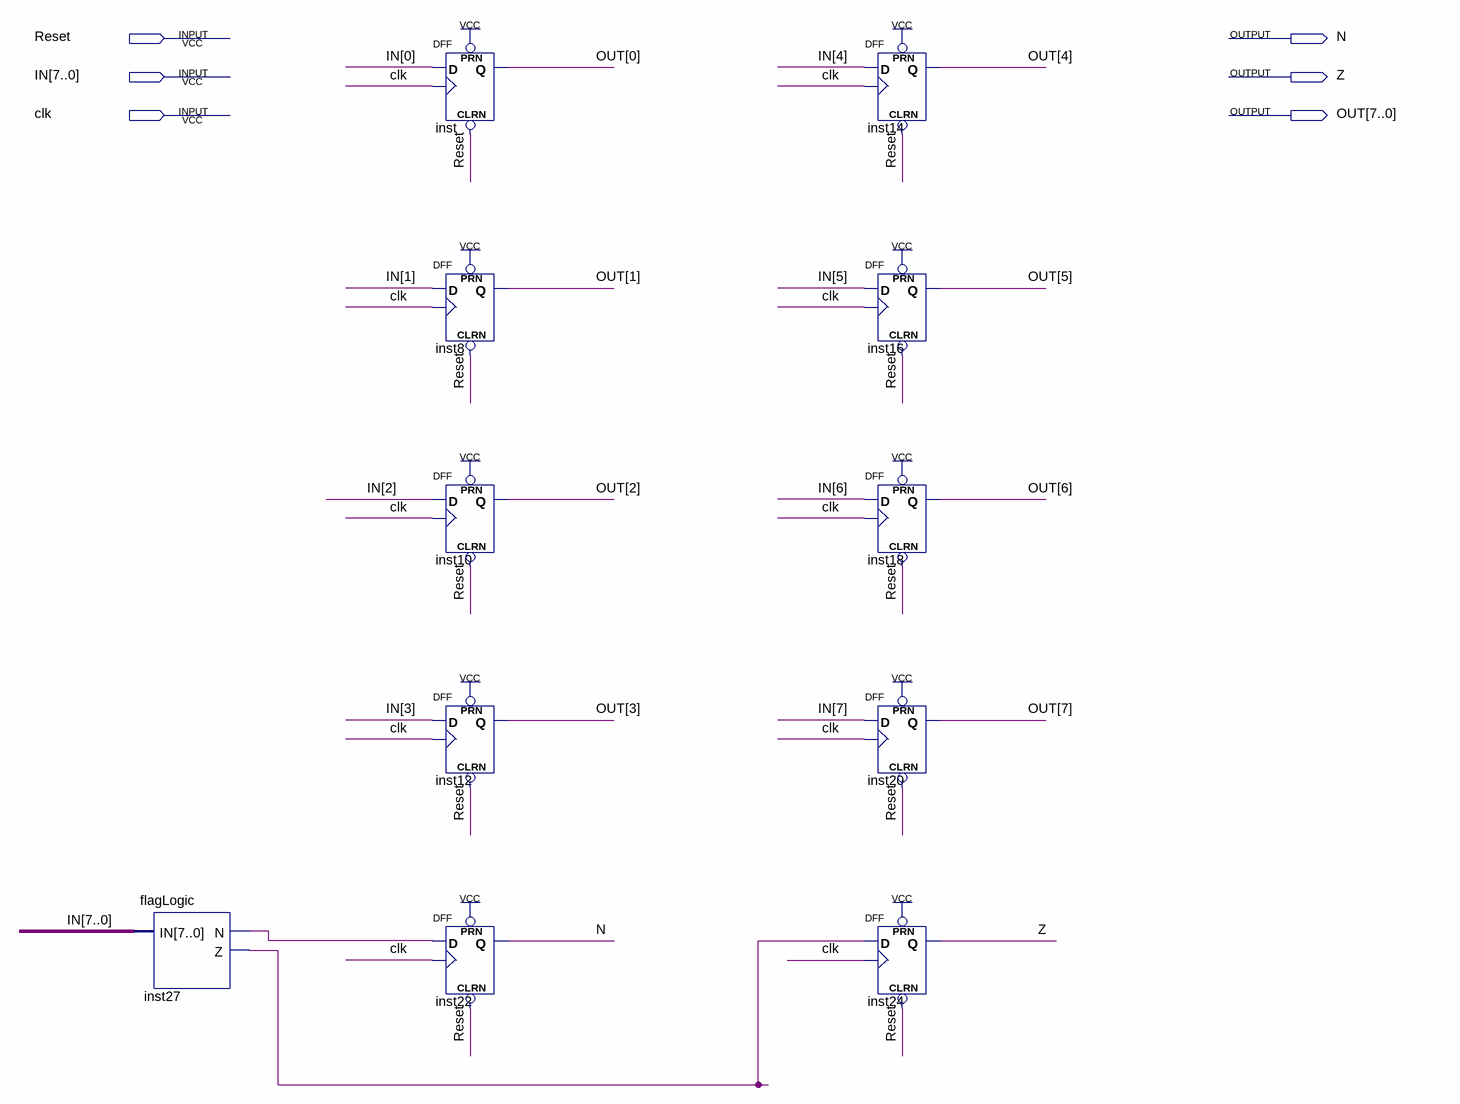
[diagram p0: schematic sheet]
// Quartus schematic AC.bdf as structural Verilog: 11 symbols, 6 pins
module AC (
  input  Reset,
  input  [7:0] IN,
  input  clk,
  output N,
  output Z,
  output [7:0] OUT
);

  wire inst27_n, inst27_z;

  flagLogic inst27 (.IN(IN), .N(inst27_n), .Z(inst27_z));
  DFF inst (.CLRN(Reset), .CLK(clk), .D(IN[0]), .PRN(1'b1), .Q(OUT[0]));
  DFF inst8 (.CLRN(Reset), .CLK(clk), .D(IN[1]), .PRN(1'b1), .Q(OUT[1]));
  DFF inst10 (.CLRN(Reset), .CLK(clk), .D(IN[2]), .PRN(1'b1), .Q(OUT[2]));
  DFF inst12 (.CLRN(Reset), .CLK(clk), .D(IN[3]), .PRN(1'b1), .Q(OUT[3]));
  DFF inst22 (.CLRN(Reset), .CLK(clk), .D(inst27_n), .PRN(1'b1), .Q(N));
  DFF inst14 (.CLRN(Reset), .CLK(clk), .D(IN[4]), .PRN(1'b1), .Q(OUT[4]));
  DFF inst16 (.CLRN(Reset), .CLK(clk), .D(IN[5]), .PRN(1'b1), .Q(OUT[5]));
  DFF inst18 (.CLRN(Reset), .CLK(clk), .D(IN[6]), .PRN(1'b1), .Q(OUT[6]));
  DFF inst20 (.CLRN(Reset), .CLK(clk), .D(IN[7]), .PRN(1'b1), .Q(OUT[7]));
  DFF inst24 (.CLRN(Reset), .CLK(clk), .D(inst27_z), .PRN(1'b1), .Q(Z));
endmodule
